# EAGLE design Placa Tran (EAGLE 9.0.1)
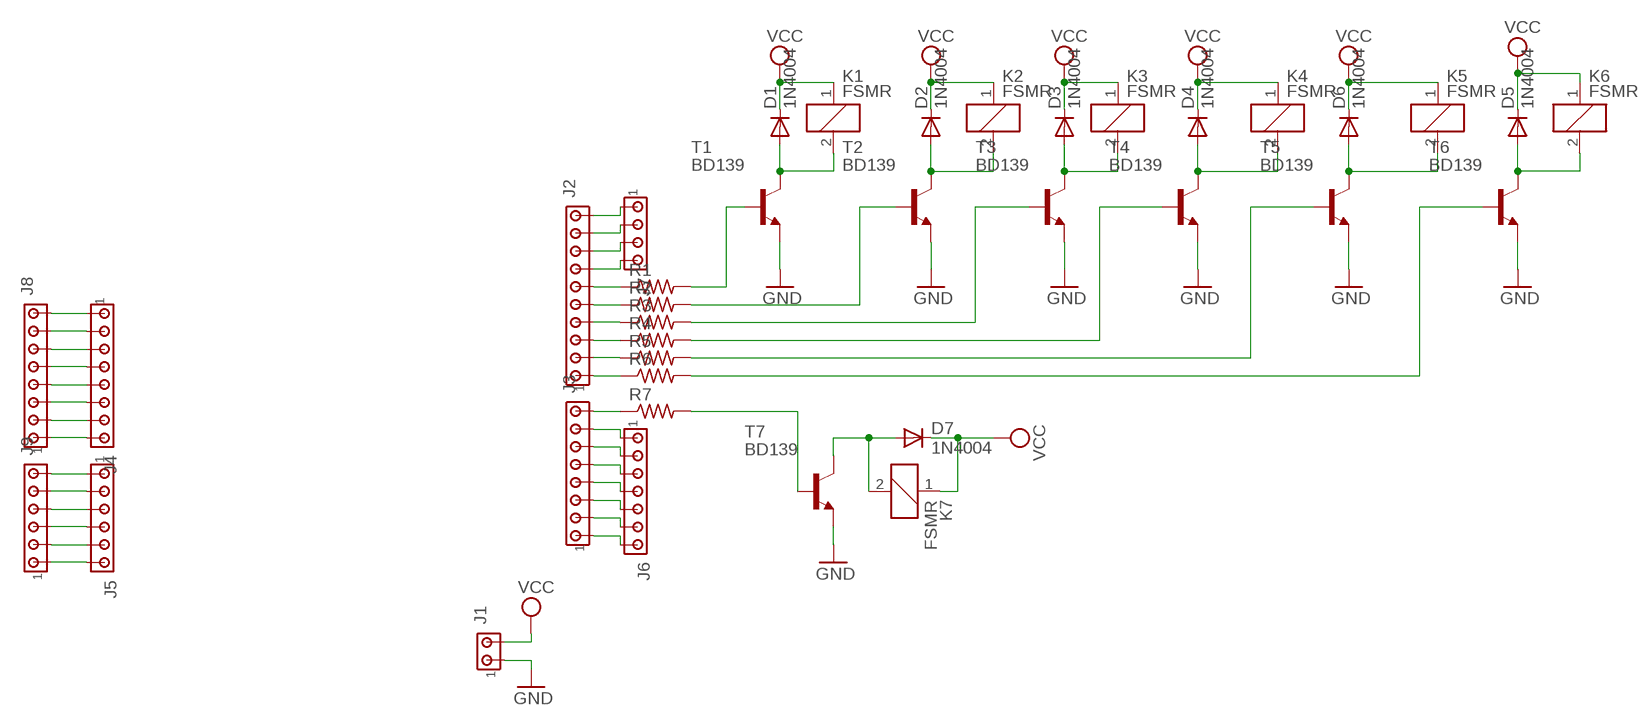
[diagram p0: schematic, sheet 1]

## Parts
D1  1N4004  [DO41-10]
D2  1N4004  [DO41-10]
D3  1N4004  [DO41-10]
D4  1N4004  [DO41-10]
D5  1N4004  [DO41-10]
D6  1N4004  [DO41-10]
D7  1N4004  [DO41-10]
J1  MTA02-156  [1X2MTA]
J2  MTA10-100  [10X10MTA]
J3  MTA08-100  [10X08MTA]
J4  MTA08-100  [10X08MTA]
J5  MTA06-100  [10X06MTA]
J6  MTA07-100  [10X07MTA]
J7  MTA04-100  [10X04MTA]
J8  MTA08-100  [10X08MTA]
J9  MTA06-100  [10X06MTA]
K1  FSMR  [FSMR]
K2  FSMR  [FSMR]
K3  FSMR  [FSMR]
K4  FSMR  [FSMR]
K5  FSMR  [FSMR]
K6  FSMR  [FSMR]
K7  FSMR  [FSMR]
R1  R-US_0207/10  [0207/10]
R2  R-US_0207/10  [0207/10]
R3  R-US_0207/10  [0207/10]
R4  R-US_0207/10  [0207/10]
R5  R-US_0207/10  [0207/10]
R6  R-US_0207/10  [0207/10]
R7  R-US_0207/10  [0207/10]
T1  BD139  [TO126]
T2  BD139  [TO126]
T3  BD139  [TO126]
T4  BD139  [TO126]
T5  BD139  [TO126]
T6  BD139  [TO126]
T7  BD139  [TO126]

## Nets
GND: J1.1 T1.1(E) T2.1(E) T3.1(E) T4.1(E) T5.1(E) T6.1(E) T7.1(E)
N$1: J2.1 R6.1
N$2: J2.2 R5.1
N$3: J2.3 R4.1
N$4: J2.4 R3.1
N$5: J2.5 R2.1
N$6: J2.6 R1.1
N$7: R1.2 T1.3(B)
N$8: D1.A K1.2 T1.2(C)
N$9: R2.2 T2.3(B)
N$10: D2.A K2.2 T2.2(C)
N$11: R3.2 T3.3(B)
N$12: D3.A K3.2 T3.2(C)
N$13: R4.2 T4.3(B)
N$14: D4.A K4.2 T4.2(C)
N$15: R5.2 T5.3(B)
N$17: R6.2 T6.3(B)
N$18: D5.A K6.2 T6.2(C)
N$19: J3.8 R7.1
N$20: R7.2 T7.3(B)
N$21: D7.A K7.2 T7.2(C)
N$22: D6.A K5.2 T5.2(C)
N$23: J3.7 J6.1
N$24: J3.6 J6.2
N$25: J3.5 J6.3
N$26: J3.4 J6.4
N$27: J3.3 J6.5
N$28: J3.2 J6.6
N$29: J3.1 J6.7
N$30: J2.7 J7.4
N$31: J2.8 J7.3
N$32: J2.9 J7.2
N$33: J2.10 J7.1
N$34: J4.1 J8.8
N$35: J4.2 J8.7
N$36: J4.3 J8.6
N$37: J4.4 J8.5
N$38: J4.5 J8.4
N$39: J4.6 J8.3
N$40: J4.7 J8.2
N$41: J4.8 J8.1
N$42: J5.1 J9.6
N$43: J5.2 J9.5
N$44: J5.3 J9.4
N$45: J5.4 J9.3
N$46: J5.5 J9.2
N$47: J5.6 J9.1
VCC: D1.C D2.C D3.C D4.C D5.C D6.C D7.C J1.2 K1.1 K2.1 K3.1 K4.1 K5.1 K6.1 K7.1
Unconnected: K1.O(2:O) K1.P(2:P) K1.P@(2:P) K1.S(2:S) K2.O(2:O) K2.P(2:P) K2.P@(2:P) K2.S(2:S) K3.O(2:O) K3.P(2:P) K3.P@(2:P) K3.S(2:S) K4.O(2:O) K4.P(2:P) K4.P@(2:P) K4.S(2:S) K5.O(2:O) K5.P(2:P) K5.P@(2:P) K5.S(2:S) K6.O(2:O) K6.P(2:P) K6.P@(2:P) K6.S(2:S) K7.O(2:O) K7.P(2:P) K7.P@(2:P) K7.S(2:S)

## Library data of the parts
D1-D7 = diode:1N4004: DIODE general purpose rectifier, 1 A
J1 = con-amp:MTA02-156: AMP connector
J2 = con-amp:MTA10-100: AMP connector
J3 J4 J8 = con-amp:MTA08-100: AMP connector
J5 J9 = con-amp:MTA06-100: AMP connector Connection corrected 2014-09-19
J6 = con-amp:MTA07-100: AMP connector
J7 = con-amp:MTA04-100: AMP connector
K1-K7 = relay:FSMR: RELAY 1 x switch, same as FBR21D/H, Fujitsu; OC_FARNELL: unknown; OC_NEWARK: unknown
R1-R7 = rcl:R-US_: RESISTOR, American symbol; SPICEPREFIX: R
T1-T7 = transistor-neu-to92:BD139: NPN TRANSISTOR

## Board
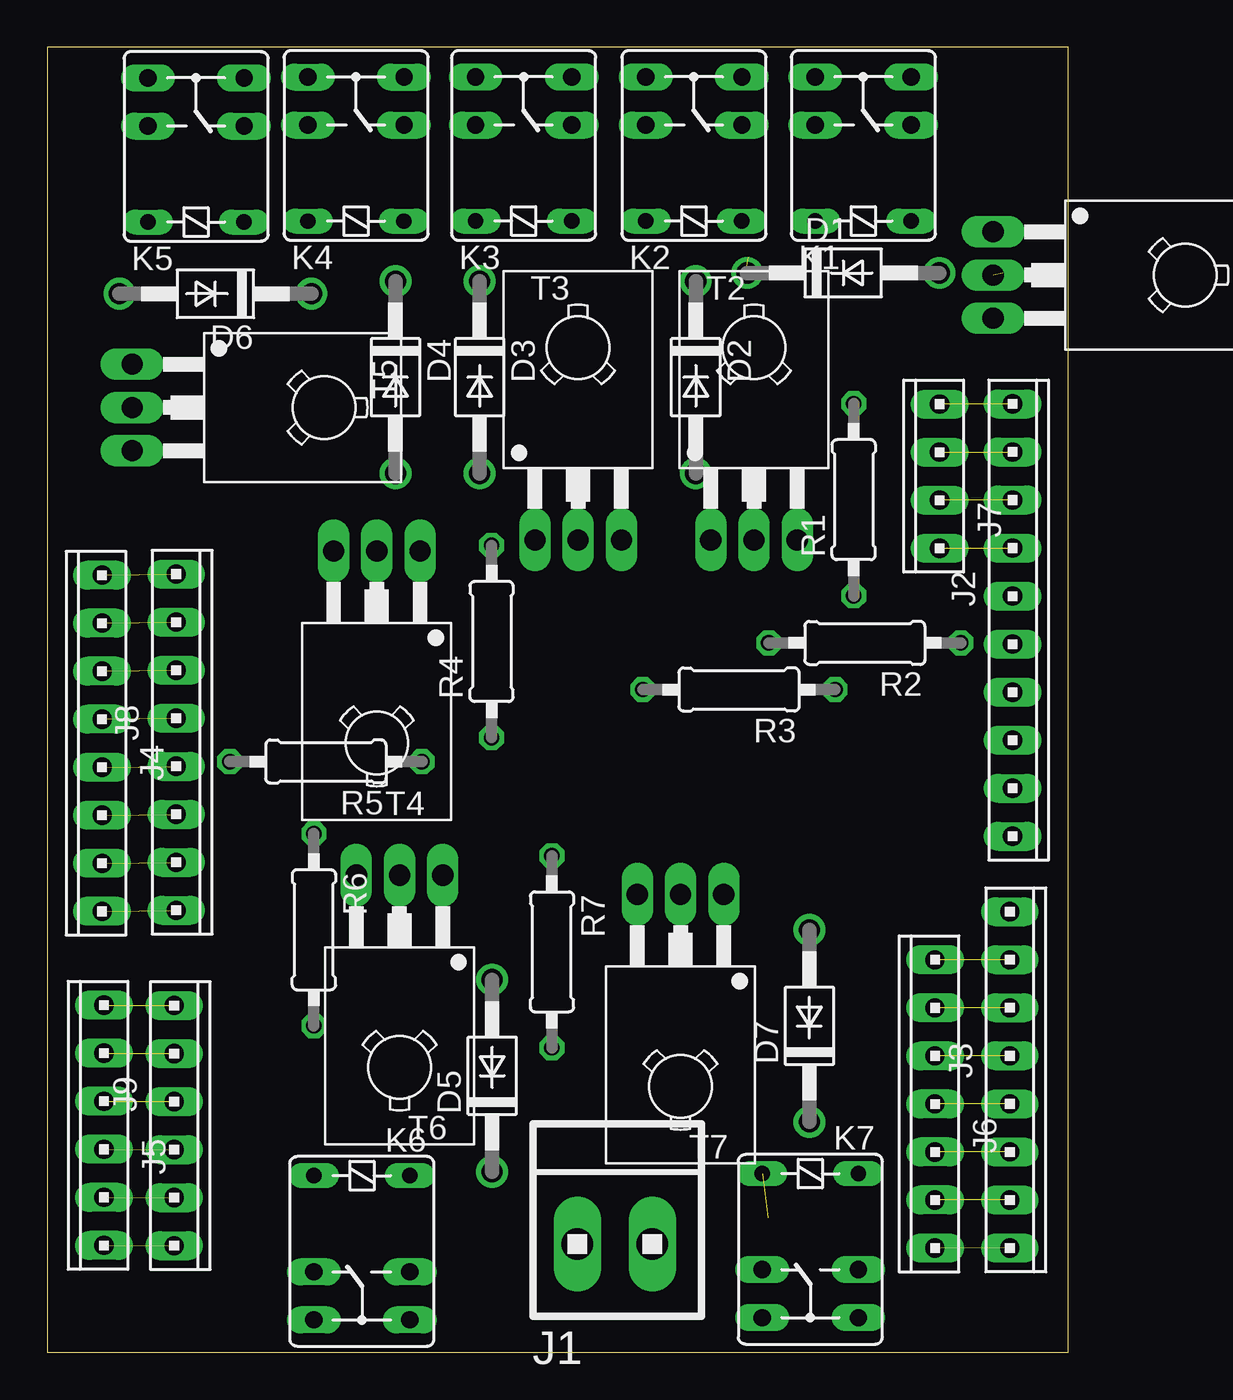
[diagram p1: board, top side]
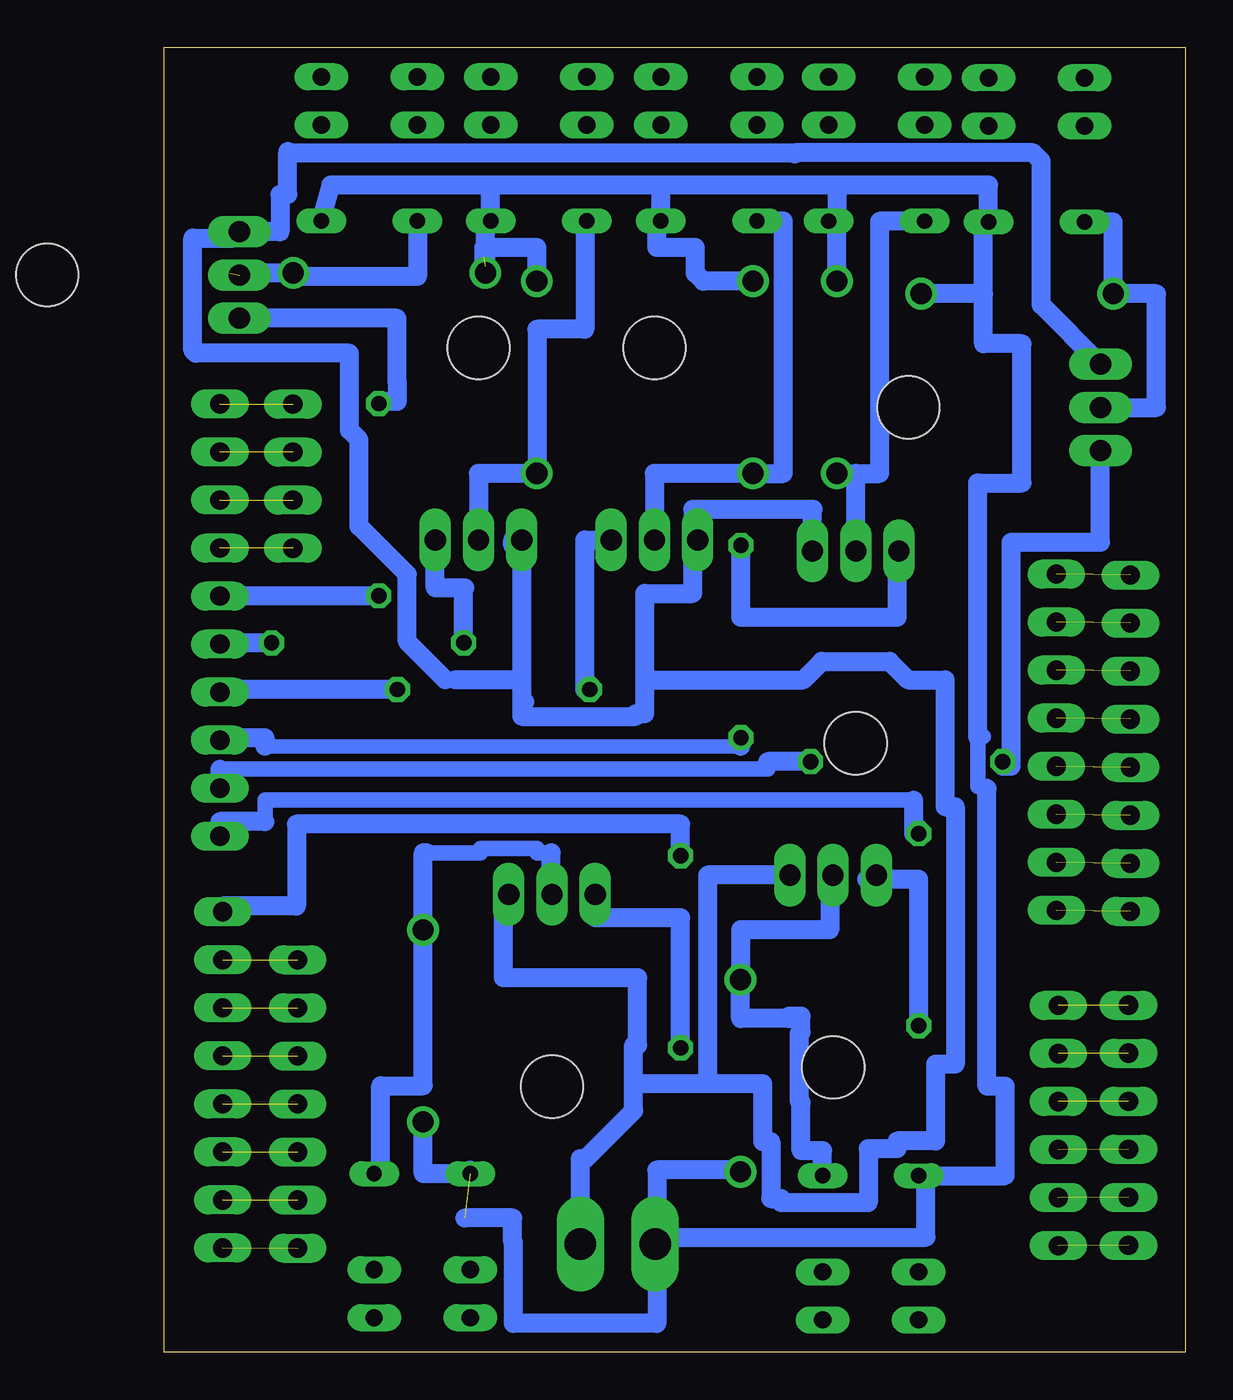
[diagram p2: board, bottom side, seen from below]

Size 54 x 69 mm. Coordinates in mm from the lower left corner, seen from the top.
Outline: 0,0 54,0 54,69 0,69 0,0
Copper layers (1*16): Top 0.035mm / dielectric 1.5mm / Bottom 0.035mm
Design rules "default": minimum track width 6mil, minimum drill 0.35mm, track to track 6mil, track to pad 6mil, pad to pad 6mil, via to via 6mil, smd to smd 6mil, copper to edge 40mil, drill to drill 6mil, minimum pad ring 10mil, minimum via ring 8mil, stop-mask expansion 4mil, vias tented up to drill 0mil, thermal gap 10mil

### Footprints (pad centres in the part's own frame; a part is rotated, then mirrored left to right if it is on the bottom)
DO41-10 = drill 1.118: A 5.08,0; C -5.08,0
1X2MTA = drill 1.676 long: 1 1.981,0; 2 -1.981,0
10X10MTA = drill 1.016 long: 1 11.43,0; 2 8.89,0; 3 6.35,0; 4 3.81,0; 5 1.27,0; 6 -1.27,0; 7 -3.81,0; 8 -6.35,0; 9 -8.89,0; 10 -11.43,0
10X08MTA = drill 1.016 long: 1 8.89,0; 2 6.35,0; 3 3.81,0; 4 1.27,0; 5 -1.27,0; 6 -3.81,0; 7 -6.35,0; 8 -8.89,0
10X06MTA = drill 1.016 long: 1 6.35,0; 2 3.81,0; 3 1.27,0; 4 -1.27,0; 5 -3.81,0; 6 -6.35,0
10X07MTA = drill 1.016 long: 1 7.62,0; 2 5.08,0; 3 2.54,0; 4 0,0; 5 -2.54,0; 6 -5.08,0; 7 -7.62,0
10X04MTA = drill 1.016 long: 1 3.81,0; 2 1.27,0; 3 -1.27,0; 4 -3.81,0
FSMR = drill 0.813 long: 1 5.08,2.54; 2 5.08,-2.54 | drill 0.914 long: O 0,2.54; P -2.54,2.54; P@ -2.54,-2.54; S 0,-2.54
0207/10 = drill 0.813 octagon: 1 -5.08,0; 2 5.08,0
TO126 = drill 1.118 long: 1 -2.286,-5.08; 2 0,-5.08; 3 2.286,-5.08 | hole 3.302: 0,5.08

### Placement (x,y rotation side)
D1  42.09,57.07 0 top
D2  34.29,51.55 270 top
D3  22.86,51.55 270 top
D4  18.41,51.55 270 top
D5  23.52,14.62 90 top
D6  8.89,55.97 180 top
D7  40.3,17.26 90 top
J1  30.01,5.72 0 top
J2  51.05,38.71 270 top
J3  50.9,14.4 270 top
J4  2.9,32.2 90 top
J5  3,12 90 top
J6  46.94,13.13 90 top
J7  47.19,46.32 90 top
J8  6.81,32.25 270 top
J9  6.71,11.98 270 top
K1  43.15,64.89 270 top
K2  34.19,64.89 270 top
K3  25.19,64.89 270 top
K4  16.32,64.89 270 top
K5  7.87,64.84 270 top
K6  16.64,4.25 90 top
K7  40.35,4.37 90 top
R1  42.64,45.08 90 top
R2  43.23,37.5 180 top
R3  36.58,35.04 180 top
R4  23.5,37.58 90 top
R5  14.73,31.23 180 top
R6  14.1,22.34 270 top
R7  26.68,21.17 270 top
T1  55.09,56.96 270 top
T2  37.37,48.03 0 top
T3  28.07,48.03 0 top
T4  17.43,37.29 180 top
T5  9.56,49.95 270 top
T6  18.63,20.15 180 top
T7  33.48,19.13 180 top

### Tracks (layer width: path | path; a pad name or v marks a point on that pad's centre or on a via)
GND
  Bottom 0.813: 38.61,35.55 39.12,35.55
  Bottom 1.016: 35.56,42.66 35.56,42.95 T2.1 35.08,35.55 | T4.1 19.71,44.54 19.68,44.56 26.04,44.56 26.04,42.95 | 26.04,42.95 T3.1 | 35.08,35.55 35.08,34.41 | 35.08,34.41 34.92,34.41 | 35.08,34.41 35.08,33.62 29.06,33.62 29.06,33.77 28.57,33.77 28.57,35.55 | 26.04,42.95 26.04,40.12 28.57,40.12 28.57,35.55 | 47.47,63.49 47.47,63.42 | 20.64,63.42 20.64,63.36 | 47.47,63.42 20.64,63.42 | J1.1 31.99,10.24 31.7,10.24 29.17,12.77 29.17,14.21 | 29.17,14.21 29.17,16.24 28.96,16.24 28.96,19.8 36.07,19.8 36.07,24.21 T7.1 | 29.17,14.21 25.26,14.21 | 28.57,35.55 20.19,35.55 19.21,36.53 15.64,36.53 14.66,35.55 12.7,35.55 12.7,28.84 12.17,28.84 12.17,15.23 13.21,15.23 13.21,11.16 15.24,11.16 15.24,10.75 16.76,10.75 16.76,7.91 21.36,7.91 21.36,8.12 21.92,8.12 21.92,11.14 22.35,11.14 22.35,14.21 25.26,14.21 | T6.1 25.26,25.23 25.26,14.21 | T5.1 7.62,55.38 7.62,62.98 8.06,63.42 20.64,63.42 | 47.47,63.42 47.47,61.23 47.87,61.23 47.87,59.24 T1.1 50.34,58.92 52.48,58.92 52.48,52.97 52.32,52.82 44.2,52.82 44.2,48.76 43.69,48.25 43.69,43.68 41.15,41.14 41.15,37.58 39.12,35.55 | 35.08,35.55 38.61,35.55
N$1
  Bottom 0.813: 14.35,29.2 48.66,29.2 48.66,28.05
  Bottom 1.016: R6.1 14.35,27.42 14.35,29.2 | J2.1 51.05,28.05 48.66,28.05
N$2
  Bottom 0.813: 22.07,31.23 22.07,30.84 51.05,30.84
  Bottom 1.016: 51.05,30.59 J2.2 51.05,30.84 | R5.1 22.07,31.23
N$3
  Bottom 0.762: 48.66,32.03 23.5,32.03
  Bottom 1.016: 52.07,32.5 51.44,32.36 | 51.44,32.36 J2.3 | R4.1 23.5,32.03 | 51.44,32.36 51.44,32.5 48.66,32.5 48.66,32.03
N$4
  Bottom 1.016: R3.1 51.05,35.04 J2.4
N$5
  Bottom 1.016: R2.1 51.05,37.5 J2.5
N$6
  Bottom 1.016: R1.1 51.03,40 J2.6
N$7
  Bottom 1.016: T1.3 41.69,54.67 41.69,51.32 41.66,51.29 41.66,50.28 42.65,50.28 R1.2
N$8  (1 unrouted)
  Bottom 1.016: K1.2 40.61,56.88 47.17,56.88 D1.A 50.52,57.07
N$9
  Bottom 1.016: 38.15,37.58 R2.2 38.15,40.41 | 38.15,40.41 38.1,40.41 | 38.15,40.41 39.66,40.41 T2.3
N$10
  Bottom 1.016: T2.2 37.37,46.47 D2.A 34.29,54.09 31.75,54.09 31.75,59.81 K2.2
N$11
  Bottom 1.016: R3.2 31.75,35.04 31.75,42.95 T3.3
N$12
  Bottom 1.016: T3.2 28.07,46.47 D3.A 21.26,46.47 21.26,59.81 K3.2
N$13
  Bottom 1.016: T4.3 15.24,42.37 15.24,38.85 23.5,38.85 R4.2
N$14
  Bottom 1.016: D4.A 17.43,46.47 | 17.43,46.47 16.17,46.47 16.17,59.81 13.28,59.81 K4.2 | T4.2 17.43,46.47
N$15
  Bottom 1.016: 9.2,30.98 9.65,30.98 R5.2 9.2,31.23 9.2,42.84 8.64,42.84 8.13,42.84 4.48,42.84 T5.3
N$17
  Bottom 1.016: R6.2 14.1,25.01 16.85,25.01 T6.3
N$18
  Bottom 1.016: K6.2 19.18,10.66 20.32,10.66 20.32,13.19 20.4,13.28 20.4,16.85 20.32,16.94 20.32,17.77 20.95,17.77 20.95,17.64 23.52,17.64 D5.A 23.52,22.34 18.8,22.34 18.8,25.23 T6.2
N$19
  Bottom 1.016: J3.8 50.9,23.59 46.99,23.59 46.99,27.93 26.68,27.93 R7.1
N$20
  Bottom 1.016: R7.2 26.68,22.98 31.2,22.98 T7.3
N$21
  Bottom 0.813: 33.53,26.4 34.27,26.4 34.27,26.65 37.27,26.65 37.27,26.4 40.13,26.4
  Bottom 1.016: K7.2 42.55,9.45 42.55,14.09 40.3,14.09 D7.A 40.3,26.4 40.13,26.4 | T7.2 33.53,24.21 33.53,26.4
N$22
  Bottom 1.016: T5.2 1.52,49.95 1.52,55.97 D6.A 3.81,59.76 K5.2
N$23  (1 unrouted)
N$24  (1 unrouted)
N$25  (1 unrouted)
N$26  (1 unrouted)
N$27  (1 unrouted)
N$28  (1 unrouted)
N$29  (1 unrouted)
N$30  (1 unrouted)
N$31  (1 unrouted)
N$32  (1 unrouted)
N$33  (1 unrouted)
N$34  (1 unrouted)
N$35  (1 unrouted)
N$36  (1 unrouted)
N$37  (1 unrouted)
N$38  (1 unrouted)
N$39  (1 unrouted)
N$40  (1 unrouted)
N$41  (1 unrouted)
N$42  (1 unrouted)
N$43  (1 unrouted)
N$44  (1 unrouted)
N$45  (1 unrouted)
N$46  (1 unrouted)
N$47  (1 unrouted)
VCC  (2 unrouted)
  Bottom 0.813: 10.49,29.81 10.49,29.91 10.97,29.91 10.97,32.55 10.67,32.55
  Bottom 1.016: D3.C 25.48,56.63 25.91,57.06 25.91,58.41 27.94,58.41 27.94,59.81 K3.1 27.73,61.71 | 18.41,61.71 27.73,61.71 | 36.73,61.71 27.94,61.71 27.73,61.71 | 36.73,61.71 45.18,61.71 K1.1 | D4.C 18.41,59.81 | K4.1 18.41,59.81 | 18.41,61.71 18.41,59.81 | 18.41,61.71 10.4,61.71 K5.1 10.67,59.76 10.67,55.97 | 27.94,4.2 27.94,9.64 23.52,9.64 D5.C | 37.81,9.64 K7.1 40.3,9.45 D7.C | 27.94,4.2 J1.2 28.03,6.08 13.72,6.08 13.72,9.33 K6.1 9.53,9.33 9.53,14.06 10.49,14.06 10.49,29.81 | 27.94,4.2 27.94,1.52 35.52,1.52 35.52,5.84 35.56,5.84 35.56,7.1 38.1,7.1 | 10.97,32.55 10.97,45.96 8.64,45.96 8.64,53.33 10.67,53.33 10.67,55.97 | 10.67,55.97 D6.C | D2.C 34.29,58.41 37.01,58.41 | 37.01,58.41 37.08,58.41 37.08,57.07 D1.C | 37.01,58.41 37.01,57.43 | 37.08,57.9 37.01,57.9 | 37.01,58.41 37.01,59.81 K2.1 36.73,61.71